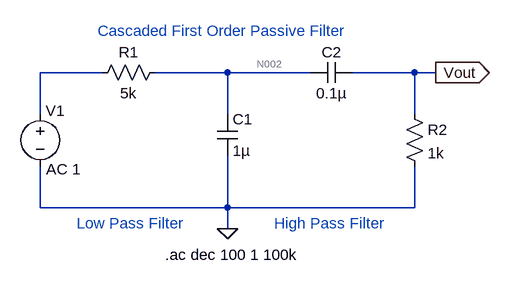
[diagram p0: schematic Cascaded First Order Passive Filter.asc]
Cascaded First Order Passive Filter.asc, the LTspice schematic file:
Version 4
SHEET 1 880 680
WIRE 16 96 -80 96
WIRE 208 96 96 96
WIRE 336 96 208 96
WIRE 496 96 400 96
WIRE 528 96 496 96
WIRE -80 160 -80 96
WIRE 208 160 208 96
WIRE 496 160 496 96
WIRE -80 304 -80 240
WIRE 208 304 208 224
WIRE 208 304 -80 304
WIRE 496 304 496 240
WIRE 496 304 208 304
WIRE 208 336 208 304
FLAG 208 336 0
FLAG 528 96 Vout
IOPIN 528 96 Out
SYMBOL cap 192 160 R0
SYMATTR InstName C1
SYMATTR Value 1µ
SYMBOL cap 400 80 R90
WINDOW 0 0 32 VBottom 2
WINDOW 3 32 32 VTop 2
SYMATTR InstName C2
SYMATTR Value 0.1µ
SYMBOL res 112 80 R90
WINDOW 0 0 56 VBottom 2
WINDOW 3 32 56 VTop 2
SYMATTR InstName R1
SYMATTR Value 5k
SYMBOL res 480 144 R0
SYMATTR InstName R2
SYMATTR Value 1k
SYMBOL voltage -80 144 R0
WINDOW 0 8 11 Left 2
WINDOW 123 9 101 Left 2
WINDOW 39 0 0 Left 0
SYMATTR InstName V1
SYMATTR Value2 AC 1
SYMATTR Value ""
TEXT 8 32 Left 2 ;Cascaded First Order Passive Filter
TEXT 112 376 Left 2 !.ac dec 100 1 100k
TEXT -24 328 Left 2 ;Low Pass Filter
TEXT 280 328 Left 2 ;High Pass Filter

The netlist it stands for:
* Cascaded First Order Passive Filter.asc
C1 N002 0 1µ
C2 Vout N002 0.1µ
R1 N002 N001 5k
R2 Vout 0 1k
V1 N001 0 AC 1
* Cascaded First Order Passive Filter
.ac dec 100 1 100k
* Low Pass Filter
* High Pass Filter
.backanno
.end

* Results of the author's LTspice run, read from the files saved beside the schematic
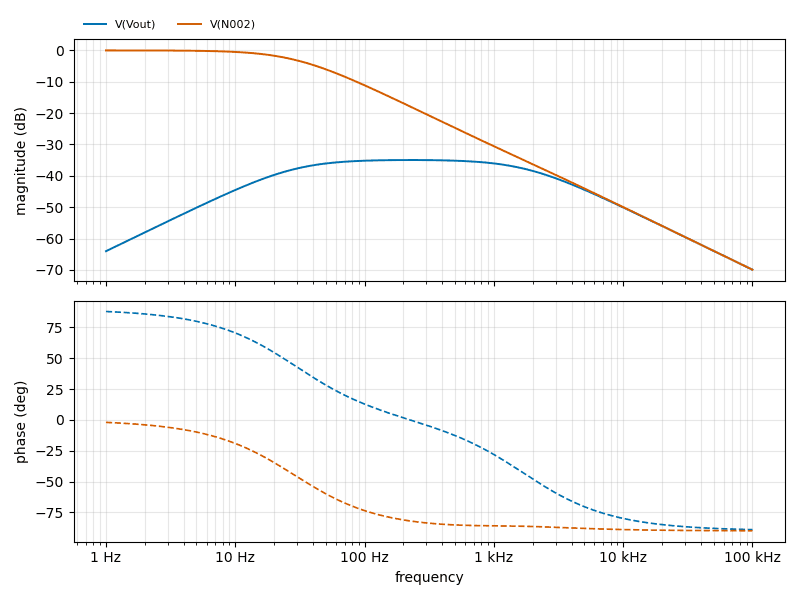
[diagram p1: AC Analysis of Cascaded First Order Passive Filter.asc, plotted from the saved traces]
* AC Analysis, 1 run:
*   V(Vout): -64.04 dB at 1 Hz, -69.94 dB at 100 kHz, peak -34.96 dB at 223.9 Hz, 3 dB below the peak at 27.98 Hz and 1.81 kHz
*   V(N002): -0.01 dB at 1 Hz, -69.94 dB at 100 kHz, peak -0.01 dB at 1 Hz, 3 dB below the peak at 28.92 Hz